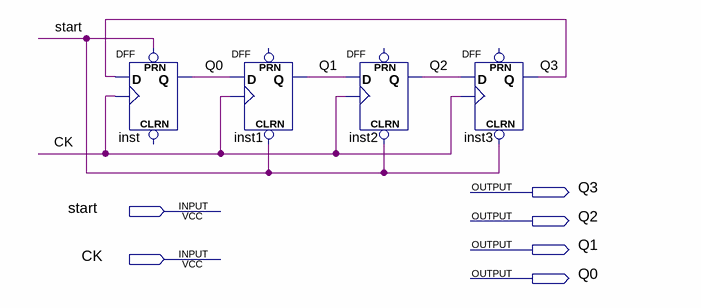
[diagram p0: schematic sheet]
// Quartus schematic 4_MOD_ring.bdf as structural Verilog: 4 symbols, 6 pins
module \4_MOD_ring  (
  input  start,
  input  CK,
  output Q3,
  output Q2,
  output Q1,
  output Q0
);

  DFF inst (.CLK(CK), .D(Q3), .PRN(start), .Q(Q0));  // open: CLRN
  DFF inst1 (.CLRN(start), .CLK(CK), .D(Q0), .Q(Q1));  // open: PRN
  DFF inst2 (.CLRN(start), .CLK(CK), .D(Q1), .Q(Q2));  // open: PRN
  DFF inst3 (.CLRN(start), .CLK(CK), .D(Q2), .Q(Q3));  // open: PRN
endmodule
